# EAGLE design gate (EAGLE 9.5.2)
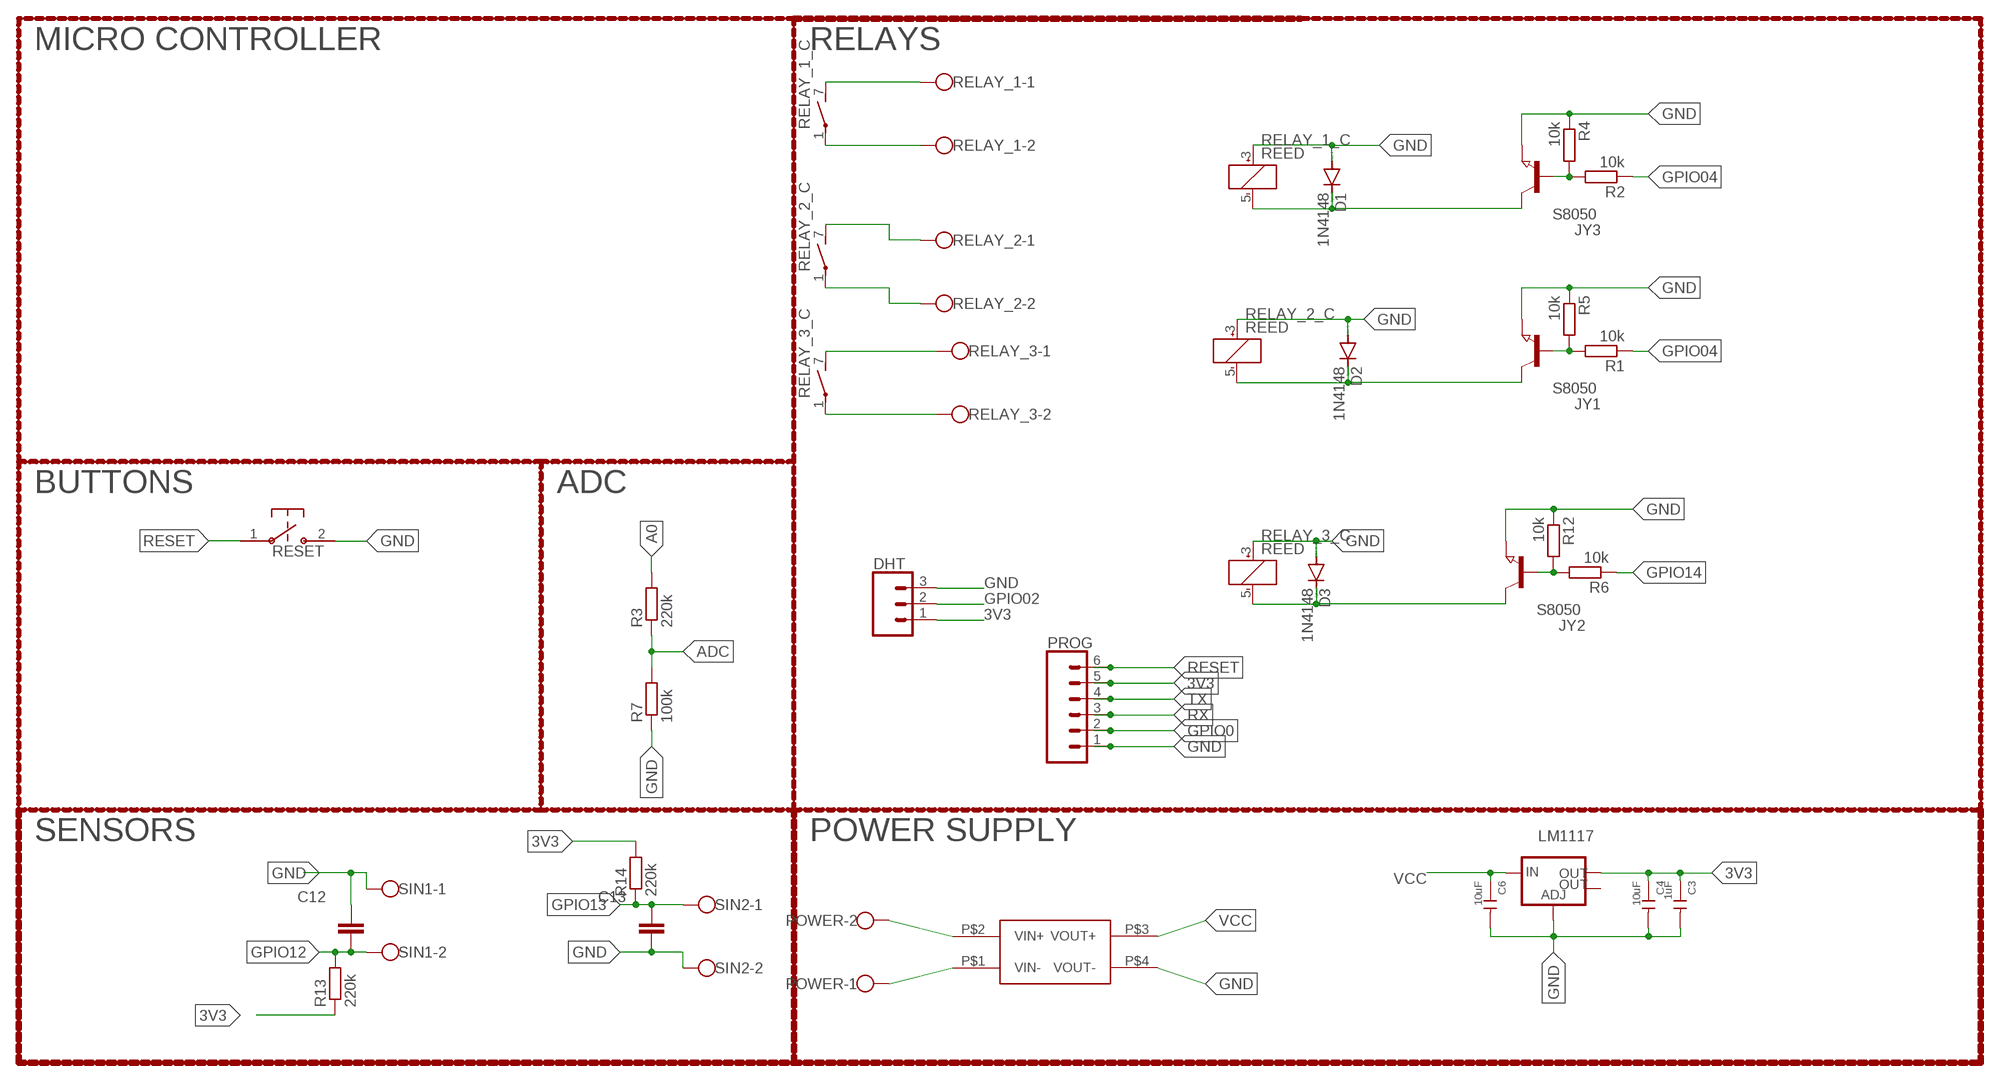
[diagram p0: schematic, sheet 1]

## Parts
AMS1117  LM1117  V_REG_LM1117SOT223  [SOT223]
C3  1uF  CERAMIC-1NF-1KV-10%-X7R(1206)  [C1206]
C4  10uF  CERAMIC-1NF-1KV-10%-X7R(1206)  [C1206]
C6  10uF  CERAMIC-1NF-1KV-10%-X7R(1206)  [C1206]
C12  C-EUC0805  [C0805]
C13  C-EUC0805  [C0805]
D1  1N4148  DIODE-SOD80C  [SOD80C]
D2  1N4148  DIODE-SOD80C  [SOD80C]
D3  1N4148  DIODE-SOD80C  [SOD80C]
DHT  CONN_03  [1X03]
JY1  S8050  NPN-TRANSISTOR_SOT23  [SOT23]
JY2  S8050  NPN-TRANSISTOR_SOT23  [SOT23]
JY3  S8050  NPN-TRANSISTOR_SOT23  [SOT23]
POWER  W237-102  [W237-102]
PROG  CONN_06NO_SILK_NO_POP  [1X06_NO_SILK]
R1  10k  R-EU_R0603  [R0603]
R2  10k  R-EU_R0603  [R0603]
R3  220k  R-EU_R0603  [R0603]
R4  10k  R-EU_R0603  [R0603]
R5  10k  R-EU_R0603  [R0603]
R6  10k  R-EU_R0603  [R0603]
R7  100k  R-EU_R0603  [R0603]
R12  10k  R-EU_R0603  [R0603]
R13  220k  R-EU_R0603  [R0603]
R14  220k  R-EU_R0603  [R0603]
RELAY_1  W237-102  [W237-102]
RELAY_1_C  REED  [REED]
RELAY_2  W237-102  [W237-102]
RELAY_2_C  REED  [REED]
RELAY_3  W237-102  [W237-102]
RELAY_3_C  REED  [REED]
RESET  B3U-1000P-2P-SMD  B3U-1000P  [B3U-1000P]
SIN1  W237-102  [W237-102]
SIN2  W237-102  [W237-102]
U$2  MP1584-MINI-SMDDL  [MINI-DC-BRICK_DL-SMD]

## Nets
3V3: AMS1117.2(OUT) C3.1 C4.1 DHT.1 PROG.5 R13.1 R14.2
A0: R3.2
ADC: R3.1 R7.2
E: D1.C JY3.3(C) RELAY_1_C.5(1:-)
F: D3.C JY2.3(C) RELAY_3_C.5(1:-)
GND: AMS1117.1(ADJ) C3.2 C4.2 C6.2 C12.1 C13.2 D1.A D2.A D3.A DHT.3 JY1.2(E) JY2.2(E) JY3.2(E) POWER.1 PROG.1 R4.1 R5.1 R7.1 R12.1 RELAY_1_C.3(1:+) RELAY_2_C.3(1:+) RELAY_3_C.3(1:+) RESET.2 SIN1.1 SIN2.2 U$2.P$1(VIN-) U$2.P$4(VOUT-)
GND1: RELAY_1.1 RELAY_1_C.7(2:S)
GND2: RELAY_2.1 RELAY_2_C.7(2:S)
GND3: RELAY_3.1 RELAY_3_C.7(2:S)
GPIO0: PROG.2
GPIO02: DHT.2
GPIO04: R1.1 R2.1
GPIO12: C12.2 R13.2 SIN1.2
GPIO13: C13.1 R14.1 SIN2.1
GPIO14: R6.1
N$1: RELAY_1.2 RELAY_1_C.1(2:P)
N$2: RELAY_2.2 RELAY_2_C.1(2:P)
N$3: RELAY_3.2 RELAY_3_C.1(2:P)
N$5: JY1.1(B) R1.2 R5.2
N$7: JY2.1(B) R6.2 R12.2
N$13: JY3.1(B) R2.2 R4.2
N$17: POWER.2 U$2.P$2(VIN+)
RESET: PROG.6 RESET.1
RX: PROG.3
T: D2.C JY1.3(C) RELAY_2_C.5(1:-)
TX: PROG.4
VCC: AMS1117.3(IN) C6.1 U$2.P$3(VOUT+)
Unconnected: AMS1117.4(OUT)

## Notes on the sheet
- MICRO CONTROLLER | RELAYS
- BUTTONS | ADC
- SENSORS | POWER SUPPLY

## Library data of the parts
AMS1117 = SparkFun-IC-Power:V_REG_LM1117: Voltage Regulator LM1117 Standard adjustable voltage regulator but in SMD form. Spark Fun Electronics SKU : COM-00595; PROD_ID: VREG-08170
C3 C4 C6 = Seeed-Capacitor:CERAMIC-1NF-1KV-10%-X7R?(1206): 302010189; MPN: CC1206KKX7RCBB102; VALUE: 1NF
C12 C13 = rcl:C-EU: CAPACITOR, European symbol; SPICEPREFIX: C
D1-D3 = diode:DIODE-: DIODE
DHT = SparkFun-Connectors:CONN_03: Multi connection point. Often used as Generic Header-pin footprint for 0.1 inch spaced/style header connections On any of the 0.1 inch spaced packages, you can populate with these: Break Away Headers - Straight <https://www.sparkfun.com/products/116> (PRT-00116) Break Away Male Headers - Right Angle <https://www.sparkfun.com/products/553> (PRT-00553) Female Headers <https://www.sparkfun.com/products/115> (PRT-00115) Break Away Headers - Machine Pin <https://www.sparkfun.com/products/117> (PRT-00117) Break Away Female Headers - Swiss Machine Pin <https://www.sparkfun.com/products/743> (PRT-00743) Stackable Header - 3 Pin (Female, 0.1") <https://www.sparkfun.com/products/13875> (PRT-13875) For SCREWTERMINALS and SPRING TERMINALS visit here: Screw Terimnals on SparkFun.com <https://www.sparkfun.com/search/results?term=Screw+Terminals> (5mm/3.5mm/2.54mm spacing) This device is also useful as a general connection point to wire up your design to another part of your project. Our various solder wires solder well into these plated through hole pads. Hook-Up Wire - Assortment (Stranded, 22 AWG) <https://www.sparkfun.com/products/11375> (PRT-11375) Hook-Up Wire - Assortment (Solid Core, 22 AWG) <https://www.sparkfun.com/products/11367> (PRT-11367) View the entire wire category on our website here <https://www.sparkfun.com/categories/141> Special notes: Molex polarized connector foot print use with SKU : PRT-08232 with associated crimp pins and housings.
JY1-JY3 = semicon-smd-ipc:NPN-TRANSISTOR_: NPN TRANSISTOR
POWER RELAY_1-RELAY_3 SIN1 SIN2 = con-wago-500:W237-102: WAGO SCREW CLAMP; MPN: 237-102; OC_FARNELL: unknown; OC_NEWARK: 70K9898
PROG = SparkFun-Connectors:CONN_06: Multi connection point. Often used as Generic Header-pin footprint for 0.1 inch spaced/style header connections On any of the 0.1 inch spaced packages, you can populate with these: Break Away Headers - Straight <https://www.sparkfun.com/products/116> (PRT-00116) Break Away Male Headers - Right Angle <https://www.sparkfun.com/products/553> (PRT-00553) Female Headers <https://www.sparkfun.com/products/115> (PRT-00115) Break Away Headers - Machine Pin <https://www.sparkfun.com/products/117> (PRT-00117) Break Away Female Headers - Swiss Machine Pin <https://www.sparkfun.com/products/743> (PRT-00743) Arduino Stackable Header - 6 Pin <https://www.sparkfun.com/products/9280> (PRT-09280) For SCREWTERMINALS and SPRING TERMINALS visit here: Screw Terimnals on SparkFun.com <https://www.sparkfun.com/search/results?term=Screw+Terminals> (5mm/3.5mm/2.54mm spacing) This device is also useful as a general connection point to wire up your design to another part of your project. Our various solder wires solder well into these plated through hole pads. Hook-Up Wire - Assortment (Stranded, 22 AWG) <https://www.sparkfun.com/products/11375> (PRT-11375) Hook-Up Wire - Assortment (Solid Core, 22 AWG) <https://www.sparkfun.com/products/11367> (PRT-11367) View the entire wire category on our website here <https://www.sparkfun.com/categories/141>
R1-R7 R12-R14 = resistor:R-EU_: RESISTOR, European symbol
RELAY_1_C RELAY_2_C RELAY_3_C = relay:REED: RELAY reed, 1 x norm. open with polarity, grid 5.08; OC_FARNELL: unknown; OC_NEWARK: unknown
RESET = switches:B3U: Switch; DIGIKEY: SW1020CT-ND; MANUFACTURER: Omron; MPN: B3U-1000P
U$2 = MP1584-dc-brick:MP1584-MINI-SMD

## Net classes
1 220V: width 1.27 mm, clearance 2 mm

## Board
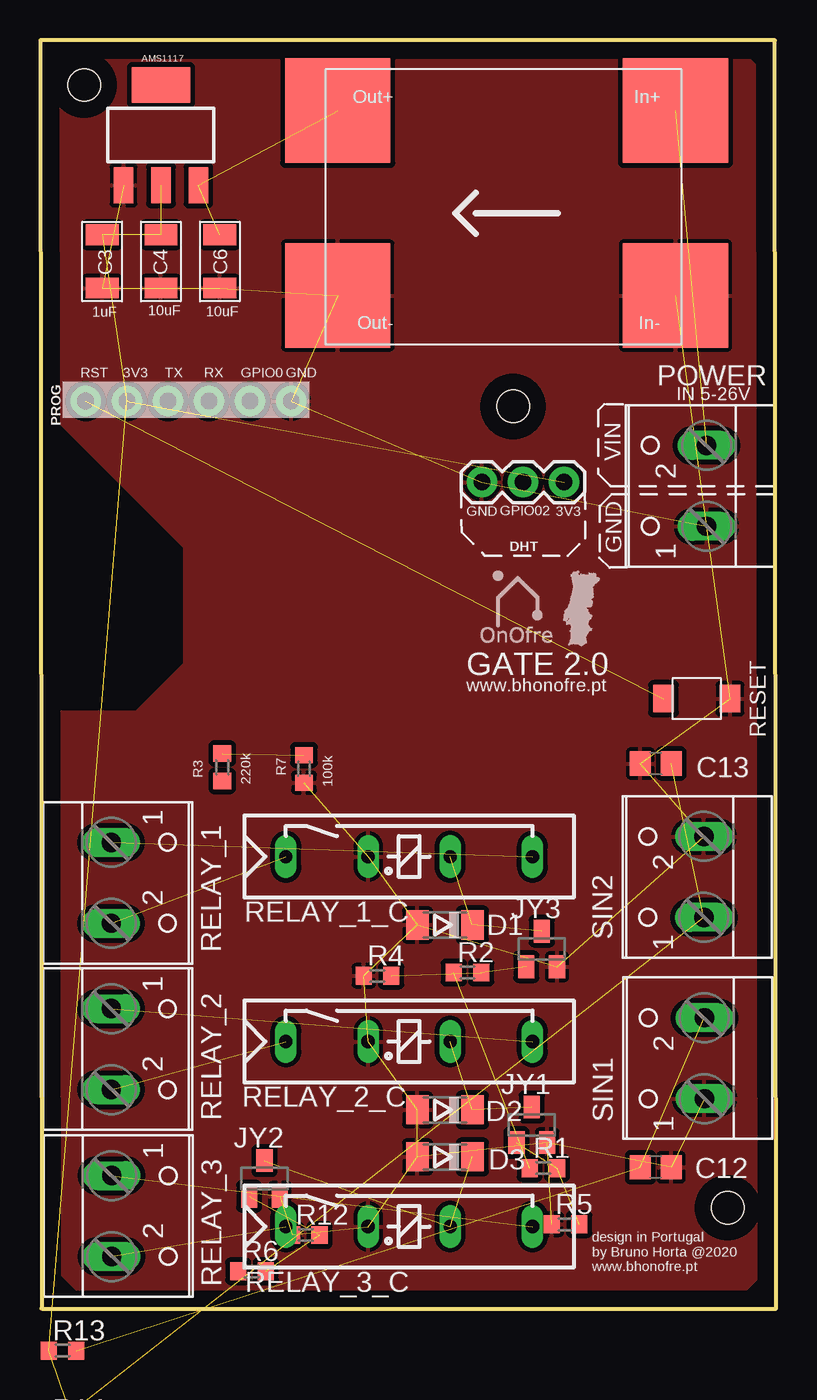
[diagram p1: board, top side]
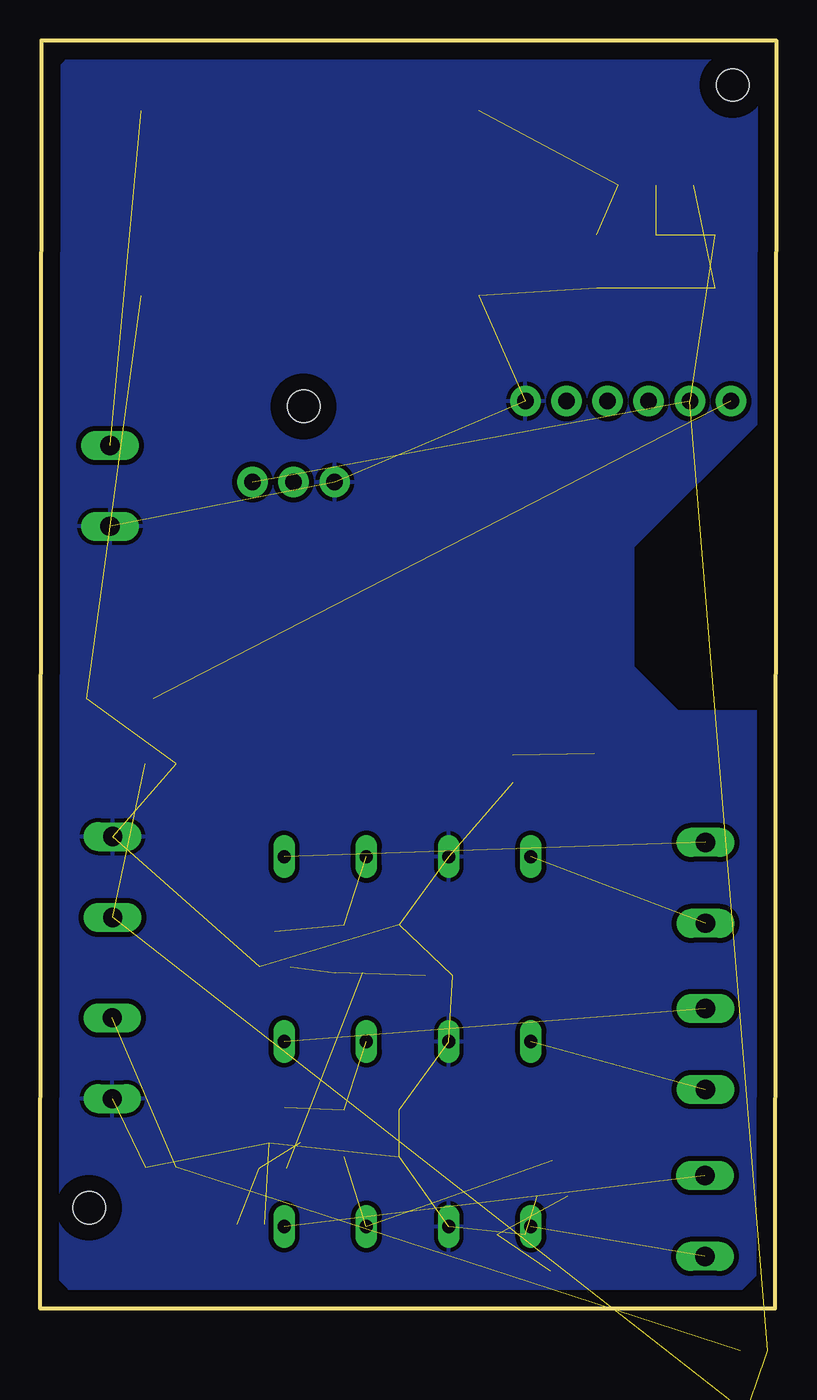
[diagram p2: board, bottom side, seen from below]

Size 45.46 x 78.37 mm. Coordinates in mm from the lower left corner, seen from the top.
Outline: 0.07,0 45.46,0 45.39,78.37 0,78.37 0.07,0
Copper layers (1*16): Top 0.035mm / dielectric 1.5mm / Bottom 0.035mm
Design rules "default": minimum track width 6mil, minimum drill 0.35mm, track to track 6mil, track to pad 6mil, pad to pad 6mil, via to via 6mil, smd to smd 6mil, copper to edge 40mil, drill to drill 6mil, minimum pad ring 10mil, minimum via ring 8mil, stop-mask expansion 4mil, vias tented up to drill 0mil, thermal gap 10mil
Holes 2 mm at 2.7,75.62 42.46,6.24 29.21,55.76

### Footprints (pad centres in the part's own frame; a part is rotated, then mirrored left to right if it is on the bottom)
SOT223 = smd 1.219 x 2.235: 1 -2.311,-3.099; 2 0,-3.099; 3 2.311,-3.099 | smd 3.6 x 2.2: 4 0,3.099
C1206 = smd 1.27 x 2.032: 1 -1.651,0; 2 1.651,0
C0805 = smd 1.3 x 1.5: 1 -0.95,0; 2 0.95,0
SOD80C = smd 1.4 x 1.8: A 1.7,0; C -1.7,0
1X03 = drill 1.016 pad 1.88: 1 0,0; 2 2.54,0; 3 5.08,0
SOT23 = smd 1 x 1.4: 1 -0.95,-1.1; 2 0.95,-1.1; 3 0,1.1
W237-102 = drill 1.194 long: 1 -2.5,-1.27; 2 2.5,-1.27
1X06_NO_SILK = drill 1.016 pad 1.88: 1 0,0; 2 2.54,0; 3 5.08,0; 4 7.62,0; 5 10.16,0; 6 12.7,0
R0603 = smd 1 x 1.1: 1 -0.85,0; 2 0.85,0
REED = drill 0.813 long: 1 -17.78,2.54; 3 -12.7,2.54; 5 -7.62,2.54; 7 -2.54,2.54
B3U-1000P = smd 1.283 x 1.7: 1 -2.056,0; 2 2.056,0
MINI-DC-BRICK_DL-SMD = smd 6.502 x 6.452: P$1 -9.804,5.08; P$2 -9.804,-6.35; P$3 11.074,-6.35; P$4 11.074,5.08

### Placement (x,y rotation side)
AMS1117  7.45,72.52 0 top
C3  3.81,64.72 270 top
C4  7.45,64.72 270 top
C6  11.08,64.72 270 top
C12  38.03,8.75 180 top
C13  38.03,33.69 180 top
D1  25,23.71 180 top
D2  25,12.29 180 top
D3  25,9.39 180 top
DHT  32.36,51.08 180 top
JY1  30.36,11.36 0 top
JY2  13.84,8.05 0 top
JY3  30.97,22.23 0 top
POWER  39.89,50.85 90 top
PROG  15.5,56.08 180 top
R1  31.08,8.69 0 top
R2  26.39,20.78 0 top
R3  11.23,33.46 270 top
R4  20.82,20.57 0 top
R5  32.45,5.22 0 top
R6  13.07,2.31 0 top
R7  16.28,33.36 90 top
R12  16.4,4.56 0 top
R13  1.37,-2.59 0 top
R14  1.37,-7.47 0 top  (outside the outline)
RELAY_1  5.64,26.32 270 top
RELAY_1_C  32.94,25.4 0 top
RELAY_2  5.64,16.04 270 top
RELAY_2_C  32.94,13.97 0 top
RELAY_3  5.67,5.73 270 top
RELAY_3_C  32.94,2.54 0 top
RESET  40.56,37.7 0 top
SIN1  39.76,15.48 90 top
SIN2  39.73,26.68 90 top
U$2  29.44,67.69 180 top

### Tracks (layer width: path | path; a pad name or v marks a point on that pad's centre or on a via)
3V3  (6 unrouted)
ADC  (1 unrouted)
E  (2 unrouted)
F  (2 unrouted)
GND  (26 unrouted)
  pour Bottom (isolate 0.305): 0.77,77.4 0.77,55.07 8.79,47.05 8.79,39.71 6.08,36.99 0.71,36.99 0.64,37.06 0.64,2.65 2.85,0.44 42.98,0.44 44.56,2.02 44.56,76.51 43.3,77.78 1.12,77.78 0.77,77.43
  pour Top (isolate 0.305): 1.15,77.81 0.74,77.4 0.74,77.31 0.74,55.15 8.83,47.06 8.83,39.85 5.89,36.91 0.67,36.91 0.61,36.98 0.61,2.75 2.92,0.44 42.92,0.44 44.53,2.05 44.53,76.55 43.24,77.84 1.31,77.84 1.24,77.78
GND1  (1 unrouted)
GND2  (1 unrouted)
GND3  (1 unrouted)
GPIO04  (1 unrouted)
GPIO12  (2 unrouted)
GPIO13  (2 unrouted)
N$1  (1 unrouted)
N$2  (1 unrouted)
N$3  (1 unrouted)
N$5  (2 unrouted)
N$7  (2 unrouted)
N$13  (2 unrouted)
N$17  (1 unrouted)
RESET  (1 unrouted)
T  (2 unrouted)
VCC  (2 unrouted)

### Text on the board
tNames: RST | 3V3 | TX | RX | GPIO0 | GND | IN 5-26V | VIN | GND | GPIO02 | 3V3 | GND | GATE 2.0 | www.bhonofre.pt | design in Portugal / by Bruno Horta @2020 / www.bhonofre.pt